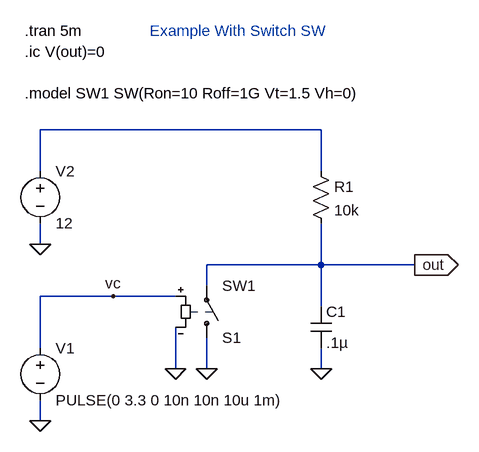
[diagram p0: schematic Switch1.asc]
Switch1.asc, the LTspice schematic file:
Version 4
SHEET 1 880 680
WIRE -256 64 -256 0
WIRE -256 176 -256 144
WIRE -256 336 -256 256
WIRE -256 448 -256 416
WIRE -144 256 -256 256
WIRE -48 256 -144 256
WIRE -48 368 -48 304
WIRE 0 240 0 208
WIRE 0 368 0 320
WIRE 176 0 -256 0
WIRE 176 64 176 0
WIRE 176 208 0 208
WIRE 176 208 176 144
WIRE 176 272 176 208
WIRE 176 368 176 336
WIRE 320 208 176 208
FLAG 176 368 0
FLAG 0 368 0
FLAG -48 368 0
FLAG -256 448 0
FLAG -256 176 0
FLAG 320 208 out
IOPIN 320 208 Out
FLAG -144 256 vc
SYMBOL res 160 48 R0
SYMATTR InstName R1
SYMATTR Value 10k
SYMBOL cap 160 272 R0
SYMATTR InstName C1
SYMATTR Value .1µ
SYMBOL sw 0 336 M180
SYMATTR InstName S1
SYMATTR Value SW1
SYMBOL voltage -256 320 R0
WINDOW 123 0 0 Left 0
WINDOW 39 0 0 Left 0
SYMATTR InstName V1
SYMATTR Value PULSE(0 3.3 0 10n 10n 10u 1m)
SYMBOL voltage -256 48 R0
WINDOW 123 0 0 Left 0
WINDOW 39 0 0 Left 0
SYMATTR InstName V2
SYMATTR Value 12
TEXT -280 -56 Left 0 !.model SW1 SW(Ron=10 Roff=1G Vt=1.5 Vh=0)
TEXT -280 -152 Left 0 !.tran 5m
TEXT -280 -120 Left 0 !.ic V(out)=0
TEXT -88 -152 Left 0 ;Example With Switch SW

The netlist it stands for:
* Switch1.asc
R1 N001 out 10k
C1 out 0 .1µ
S1 0 out vc 0 SW1
V1 vc 0 PULSE(0 3.3 0 10n 10n 10u 1m)
V2 N001 0 12
.model SW1 SW(Ron=10 Roff=1G Vt=1.5 Vh=0)
.tran 5m
.ic V(out)=0
* Example With Switch SW
.backanno
.end